# EasyEDA schematic 1 VLF Receiver V1.json
TITLE: VLF Receiver; REV: 1.0; Date: 2017-09-11; Sheet: 1/1; Drawn By: Blazej SQ2MTG
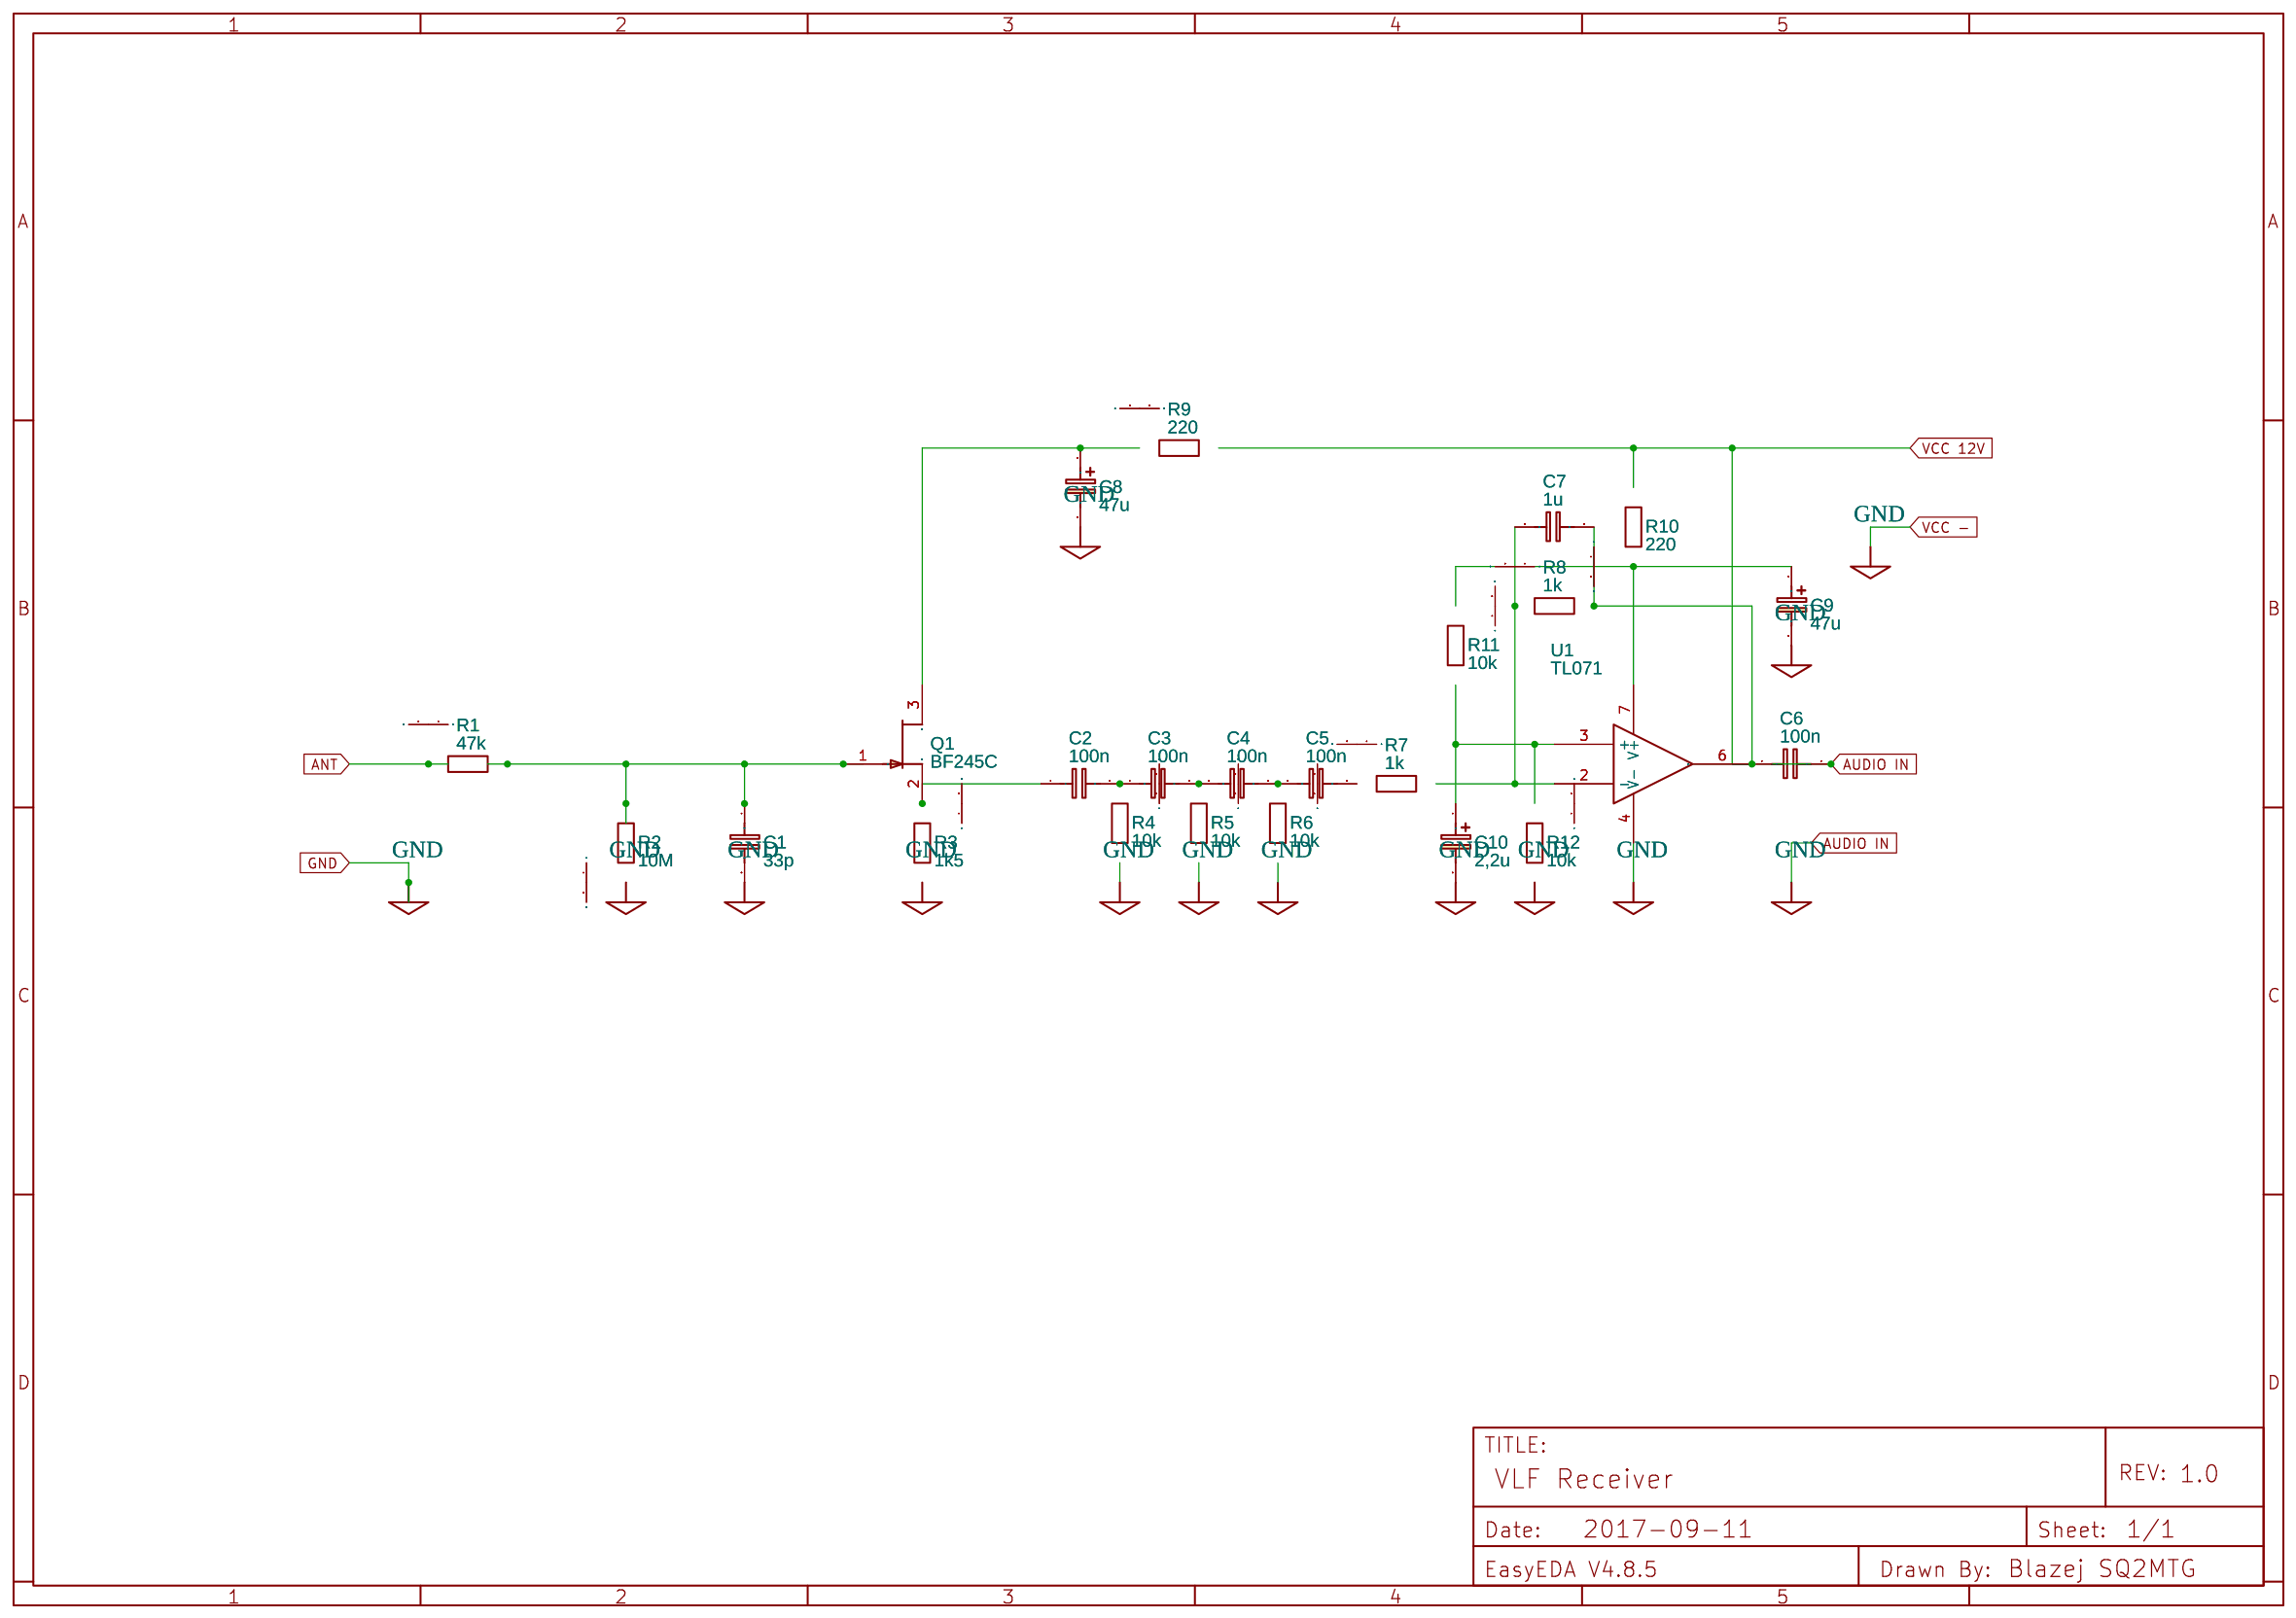
[diagram p0: schematic sheet]

## Parts
C1  33p  [RAD-0.1]
C2  100n  [RAD-0.1]
C3  100n  [RAD-0.1]
C4  100n  [RAD-0.1]
C5  100n  [RAD-0.1]
C6  100n  [RAD-0.1]
C7  1u  [RAD-0.1]
C8  47u  [CAP-TAN-S2.5]
C9  47u  [CAP-TAN-S2.5]
C10  2,2u  [CAP-TAN-S2.5]
Q1  BF245C  [TO92-INLINE]
R1  47k  [AXIAL-0.3]
R2  10M  [AXIAL-0.3]
R3  1k5  [AXIAL-0.3]
R4  10k  [AXIAL-0.3]
R5  10k  [AXIAL-0.3]
R6  10k  [AXIAL-0.3]
R7  1k  [AXIAL-0.3]
R8  1k  [AXIAL-0.3]
R9  220  [AXIAL-0.3]
R10  220  [AXIAL-0.3]
R11  10k  [AXIAL-0.3]
R12  10k  [AXIAL-0.3]
U1  TL071  [DIP 8]

## Library data of the parts
C1-C10 = Capacitor: Manufacturer Part: ?
Q1 = -: JFET VHF  UHF Amplifier; catid: 20; Manufacturer Part: ?
R1-R12 = Resistor: Manufacturer Part: ?
U1 = -: catid: 20; Contributor: KiCad; Manufacturer Part: ?

## Nets
ANT: R1.1
AUDIO IN: C1.2 C6.1 C6.2 C7.2 C8.2 C9.2 C10.2 R2.1 R3.2 R4.2 R5.2 R6.2 R8.2 R9.2 R10.2 R12.2 U1.4(V-) U1.6
Net-(C1-1): C1.1 Q1.1(G) R1.2 R2.2
Net-(C2-1): C2.1 Q1.2(S) R3.1
Net-(C2-2): C2.2 C3.1 R4.1
Net-(C3-2): C3.2 C4.1 R5.1
Net-(C4-2): C4.2 C5.1 R6.1
Net-(C5-2): C5.2 R7.1
Net-(C7-1): C7.1 R7.2 R8.1 U1.2(-)
Net-(C8-1): C8.1 Q1.3(D) R9.1
Net-(C9-1): C9.1 R10.1 R11.1 U1.7(V+)
Net-(C10-1): C10.1 R11.2 R12.1 U1.3(+)
